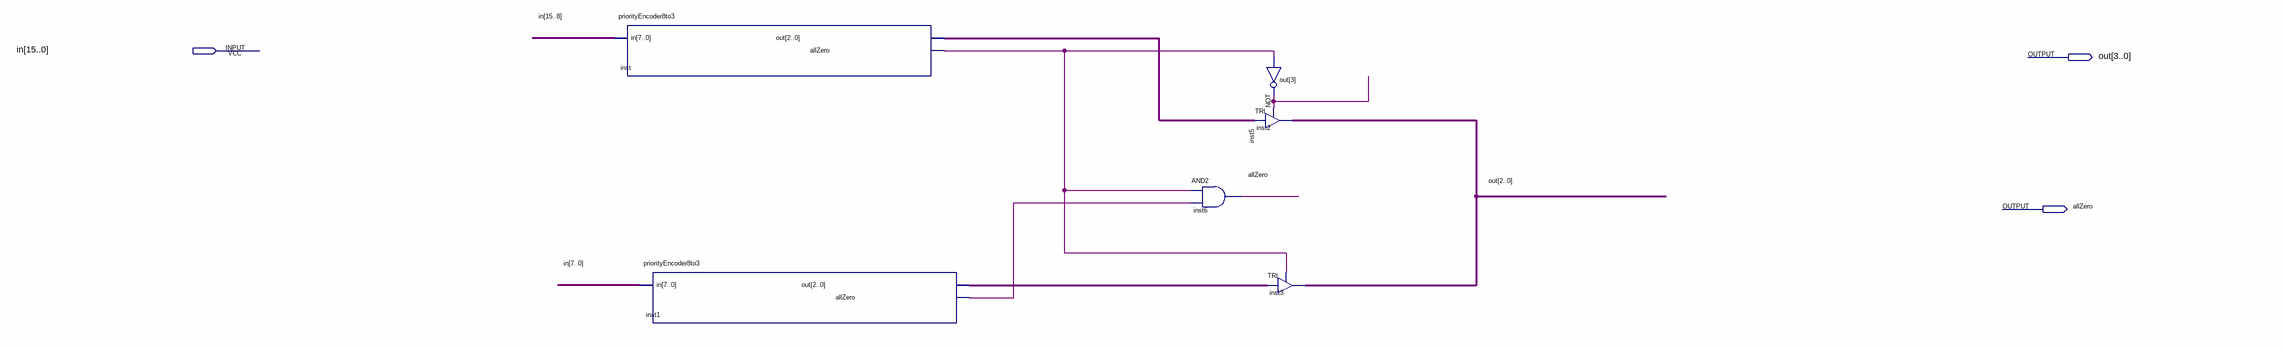
[diagram p0: schematic sheet]
// Quartus schematic priorityEncoder16to4.bdf as structural Verilog: 6 symbols, 3 pins
module priorityEncoder16to4 (
  input  [15:0] in,
  output [3:0] out,
  output allZero
);

  wire inst1_allzero, inst_allzero;
  wire [2:0] inst1_out, inst_out;

  priorityEncoder8to3 inst (.in(in[15:8]), .out(inst_out), .allZero(inst_allzero));
  priorityEncoder8to3 inst1 (.in(in[7:0]), .out(inst1_out), .allZero(inst1_allzero));
  and inst6 (allZero, inst_allzero, inst1_allzero);
  not inst5 (out[3], inst_allzero);
  TRI inst2[2:0] (.IN(inst_out), .OE(out[3]), .OUT(out[2:0]));
  TRI inst3[2:0] (.IN(inst1_out), .OE(inst_allzero), .OUT(out[2:0]));
endmodule
